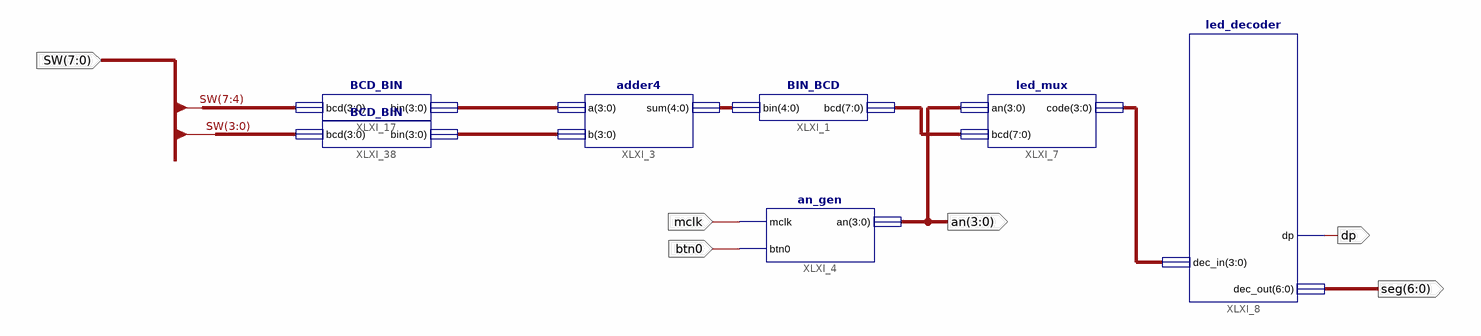
[diagram p0: schematic sheet 1]
// Xilinx ISE schematic main.sch (spartan3e) as structural Verilog: 7 symbols, 6 ports
module main (
  input  [7:0] SW,
  input  mclk,
  input  btn0,
  output [3:0] an,
  output [6:0] seg,
  output dp
);

  wire [3:0] XLXN_14, XLXN_60, XLXN_62;
  wire [4:0] XLXN_3;
  wire [7:0] XLXN_13;

  BCD_BIN XLXI_17 (.bcd(SW[7:4]), .bin(XLXN_60));
  adder4 XLXI_3 (.a(XLXN_60), .b(XLXN_62), .sum(XLXN_3));
  BIN_BCD XLXI_1 (.bin(XLXN_3), .bcd(XLXN_13));
  led_mux XLXI_7 (.an(an), .bcd(XLXN_13), .code(XLXN_14));
  led_decoder XLXI_8 (.dec_in(XLXN_14), .dp(dp), .dec_out(seg));
  an_gen XLXI_4 (.mclk(mclk), .btn0(btn0), .an(an));
  BCD_BIN XLXI_38 (.bcd(SW[3:0]), .bin(XLXN_62));
endmodule
